# Altium schematic sheet PreAmplifier_ToneController.SchDoc
size A4; SheetNumber: 3; SheetTotal: 4
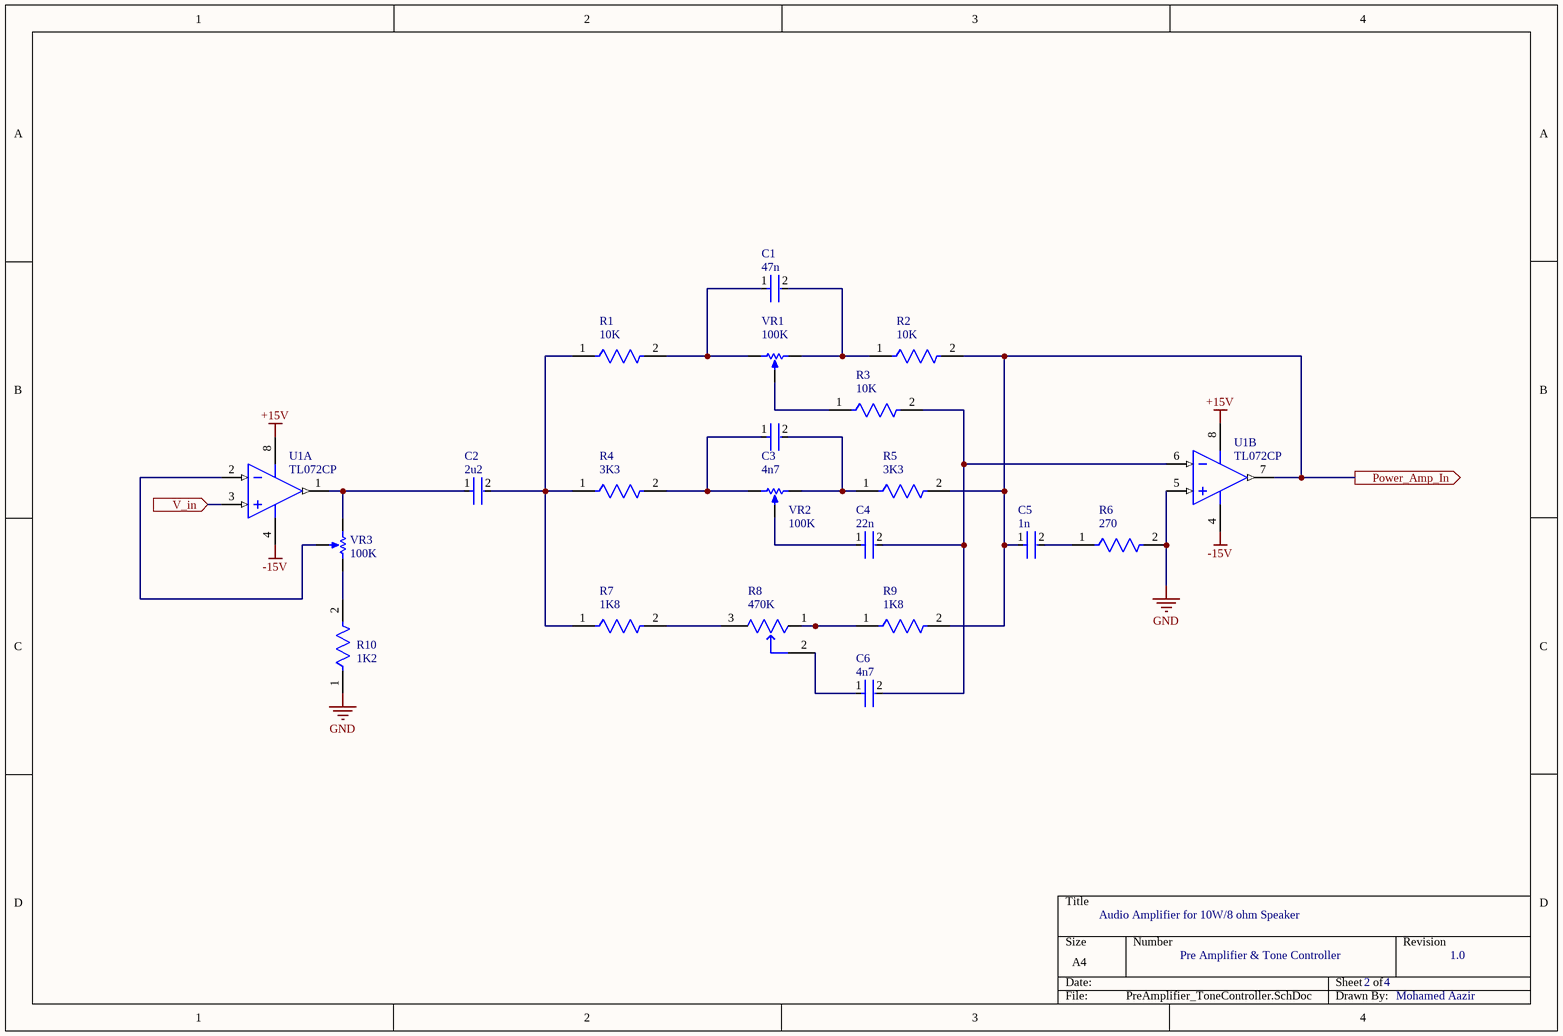
[diagram p0: PreAmplifier_ToneController.SchDoc]

## Parts
C1  47n  [FP-RAD-TH-D_5_0_5-L_11_1-MFG]
C2  2u2  [FP-RAD-TH-D_5_0_5-L_11_1-MFG]
C3  4n7  [FP-RAD-TH-D_5_0_5-L_11_1-MFG]
C4  22n  [FP-RAD-TH-D_5_0_5-L_11_1-MFG]
C5  1n  [FP-RAD-TH-D_5_0_5-L_11_1-MFG]
C6  4n7  [FP-RAD-TH-D_5_0_5-L_11_1-MFG]
R1  10K  [FP-MFR-25-MFG]
R2  10K  [FP-MFR-25-MFG]
R3  10K  [FP-MFR-25-MFG]
R4  3K3  [FP-MFR-25-MFG]
R5  3K3  [FP-MFR-25-MFG]
R6  270  [FP-MFR-25-MFG]
R7  1K8  [FP-MFR-25-MFG]
R8  470K  [FP-PV37W-MFG]
R9  1K8  [FP-MFR-25-MFG]
R10  1K2  [FP-MFR-25-MFG]
U1  TL072CP  [P0008A]  (parts A,B of 2)
VR1  100K  [BOUR-3362P]
VR2  100K  [BOUR-3362P]
VR3  100K  [BOUR-3362P]

## Ports
Power_Amp_In (out, see TopLevelDesign[2B], PowerAmp[2C]), V_in (in, see TopLevelDesign[2B], InputOutputPower[3B])

## Nets
+15V: U1.8(VCC+)
-15V: U1.4(VCC-)
GND: R6.2 R10.1 U1.5(IN2+)
Power_Amp_In: C5.1 R2.2 R5.2 R9.2 U1.7(OUT2) ; port Power_Amp_In
V_in: U1.3(IN1+) ; port V_in
NetC1_1: C1.1 R1.2 VR1.1(CCW)
NetC1_2: C1.2 R2.1 VR1.3(CW)
NetC2_1: C2.1 U1.1(OUT1) VR3.1(CCW)
NetC2_2: C2.2 R1.1 R4.1 R7.1
NetC3_1: C3.1 R4.2 VR2.1(CCW)
NetC3_2: C3.2 R5.1 VR2.3(CW)
NetC4_1: C4.1 VR2.2(S)
NetC4_2: C4.2 C6.2 R3.2 U1.6(IN2-)
NetC5_2: C5.2 R6.1
NetC6_1: C6.1 R8.2
NetR3_1: R3.1 VR1.2(S)
NetR7_2: R7.2 R8.3
NetR8_1: R8.1 R9.1
NetR10_2: R10.2 VR3.3(CW)
NetU1_2: U1.2(IN1-) VR3.2(S)

## Notes on the sheet
- Audio Amplifier for 10W/8 ohm Speaker
- Pre Amplifier & Tone Controller
- 2
- 4
- 1.0
- Mohamed Aazir

## Library data of the parts
C1-C6 = CMP-05427-002189-1: Aluminum Electrolytic Capacitors (Radial Lead Type) 22uF ±20% 25V; Dissipation Factor: 0.15%; Ripple Current: 60mA; Life (Hours): 2000Hour; Leakage Current: 3mA; Polarity: Bipolar; Lead Diameter: 0.5mm; Voltage Rating (DC): 25V; Capacitance: 22uF; Height: 11mm; Construction: RADIAL; Min Operating Temperature: -40°C; Tolerance: 20%; Max Operating Temperature: 85°C; Reach SVHC Compliant: Yes; Diameter: 5mm; Package Quantity: 200; Case/Package: Radial; Mount: Through Hole; Length: 11mm; Radiation Hardening: No; Size: 11mm; Height - Seated (Max): 0.433inch; Packaging: Bulk; Series: SU; Termination: Radial; Voltage: 25V; Voltage Rating: 25V; Lead Pitch: 2mm; RoHS Compliant: Yes; Lead Free: Lead Free
R1-R7 R9 R10 = CMP-03413-000001-1: RES 1.18K OHM 1/4W 1% AXIAL; Manufacturer: Yageo; Manufacturer Part Number: MFR-25FBF52-1K18; Value: 1.18kΩ; Temperature Coefficient: 100ppm/°C; Power Rating: 0.25W; Voltage Rating: 250V; Temperature: -55°C to +155°C; Automotive: No; Temperature Range High: +155°C; Mouser Description: Metal Film Resistors 1.18K OHM 1/4W 1%; Digikey Description: RES 1.18K OHM 1/4W 1% AXIAL; Lead Free: Yes; Tolerance: 1%; ComponentLink2Description: Datasheet; ComponentLink2URL: https://www.yageo.com/upload/media/product/products/datasheet/lr/Yageo_LR_MFR_1.pdf; Temperature Range Low: -55°C; Package: MFR-25; Ipc Land Pattern Name: RESAD1000W75L680D260; Composition: Metal Film; Category: Res; Octopart: https://octopart.com/mfr-25fbf52-1k18-yageo-56251681; Series: MFR; Device Class L2: Resistors; Height: 2.6mm; Resistance: 1.18kΩ; Device Class L3: Through-Hole Resistors; RoHS: TRUE; Device Class L1: Passive Components
R8 = CMP-07234-000004-1: TRIMMER 500KOHM 0.25W PC PIN TOP; Manufacturer Part Number: PV37W504C01B00; Manufacturer: Bourns; Value: 500kΩ; Tolerance: 10%; Temperature Coefficient: 150ppm/°C; Standoff Height: 0.33mm; Temperature Range Low: -55°C; Package: PV37W; Height: 9.02mm; Series: PV37; Mouser Description: Res Cermet Trimmer 500K Ohm 10% 1/4W 12(Elec)Turn 1.8mm (6.4 X 4 X 7.7mm) Pin Thru-Hole Bulk; Power Rating: 0.25W; Device Class L3: Variable Resistors and Potentiometers; Device Class L2: Resistors; Category: Res; RoHS: TRUE; Lead Free: Yes; Composition: Cermet; Automotive: No; Digikey Description: TRIMMER 500KOHM 0.25W PC PIN TOP; Temperature Range High: +125°C; Resistance: 500kΩ; Temperature: -55°C to +125°C; Octopart: https://octopart.com/pv37w504c01b00-bourns-71526902; Device Class L1: Passive Components; ComponentLink2Description: Datasheet; ComponentLink2URL: https://www.bourns.com/docs/Product-Datasheets/pv37.pdf
U1 = CMP-0017-00950-2: Dual Low-Noise JFET-Input General-Purpose Operational Amplifier, 7 to 36 V, 0 to 70 degC, 8-pin DIP (P8), Pb-Free (RoHS); Manufacturer: Texas Instruments; Sub Family: General Purpose Amplifier, High Supply Voltage Amplifier (>=30V); Total Supply Voltage(Max)(+5V is 5, +/-5V is 10): 36; Slew Rate(Typ)(V/us): 13; Vn at 1kHz(Typ)(nV/rtHz): 18; GBW(Typ)(MHz): 3; CMRR(Min)(dB): 70; Total Supply Voltage(Min)(+5V is 5, +/-5V is 10): 7; Vio (25C)(Max)(mV): 10; Rating: Catalog; IIB(Max)(pA): 200; Iq per channel(Max)(mA): 2.5; Number of Channels: 2; Mounting Technology: Through Hole; ComponentLink3Description: Package Specification; PartNumber: TL072CP; PackageVersion: 4040082/E, 04/2010; Eco-Plan: Pb-Free (RoHS); DatasheetVersion: SLOS080J; Offset Drift(Typ)(uV/C): 18; ComponentLink3URL: http://www.ti.com/litv/pdf/mpdi001b; PackageDescription: 8-Pin Plastic In-Line, Body 9.59 x 6.35 mm, Pitch 2.54 mm; Code_JEDEC: MS-001; ComponentLink2URL: http://www.ti.com/lit/ds/symlink/tl072.pdf; ComponentLink1Description: Manufacturer URL; ComponentLink2Description: Datasheet; ComponentLink1URL: http://www.ti.com/; PackageReference: P0008A
VR1-VR3 = CMP-1747-00003-1: Square Trimpot(R) Trimming Potentiometer, 100 KOhm, 300 V, -55 to 125 degC, 3-Pin THD, RoHS, Tube; Voltage Rating: 250 V; Case\Package: Axial; Tolerance: 1%; Power Rating: 250 mW; Resistance: 1 mohm; RoHSCompliant: true; ComponentLink2URL: http://www.bourns.com/docs/Product-Datasheets/3362.pdf; ComponentLink1Description: Manufacturer URL; DatasheetVersion: May-16; Package Quantity: 200; ComponentLink2Description: Datasheet; Min Operating Temperature: -55 degC; Mount: Through Hole; PackageDescription: 3-Pin Through Hole Device, Body 6.6 x 6.99 mm, Pitch 2.54 mm; Length: 0.248 inch; ComponentLink1URL: http://www.bourns.com/; PackageReference: 3326P; Max Operating Temperature: 155 degC; Packaging: Bulk